# EAGLE schematic roverPCB (EAGLE 9.5.1)
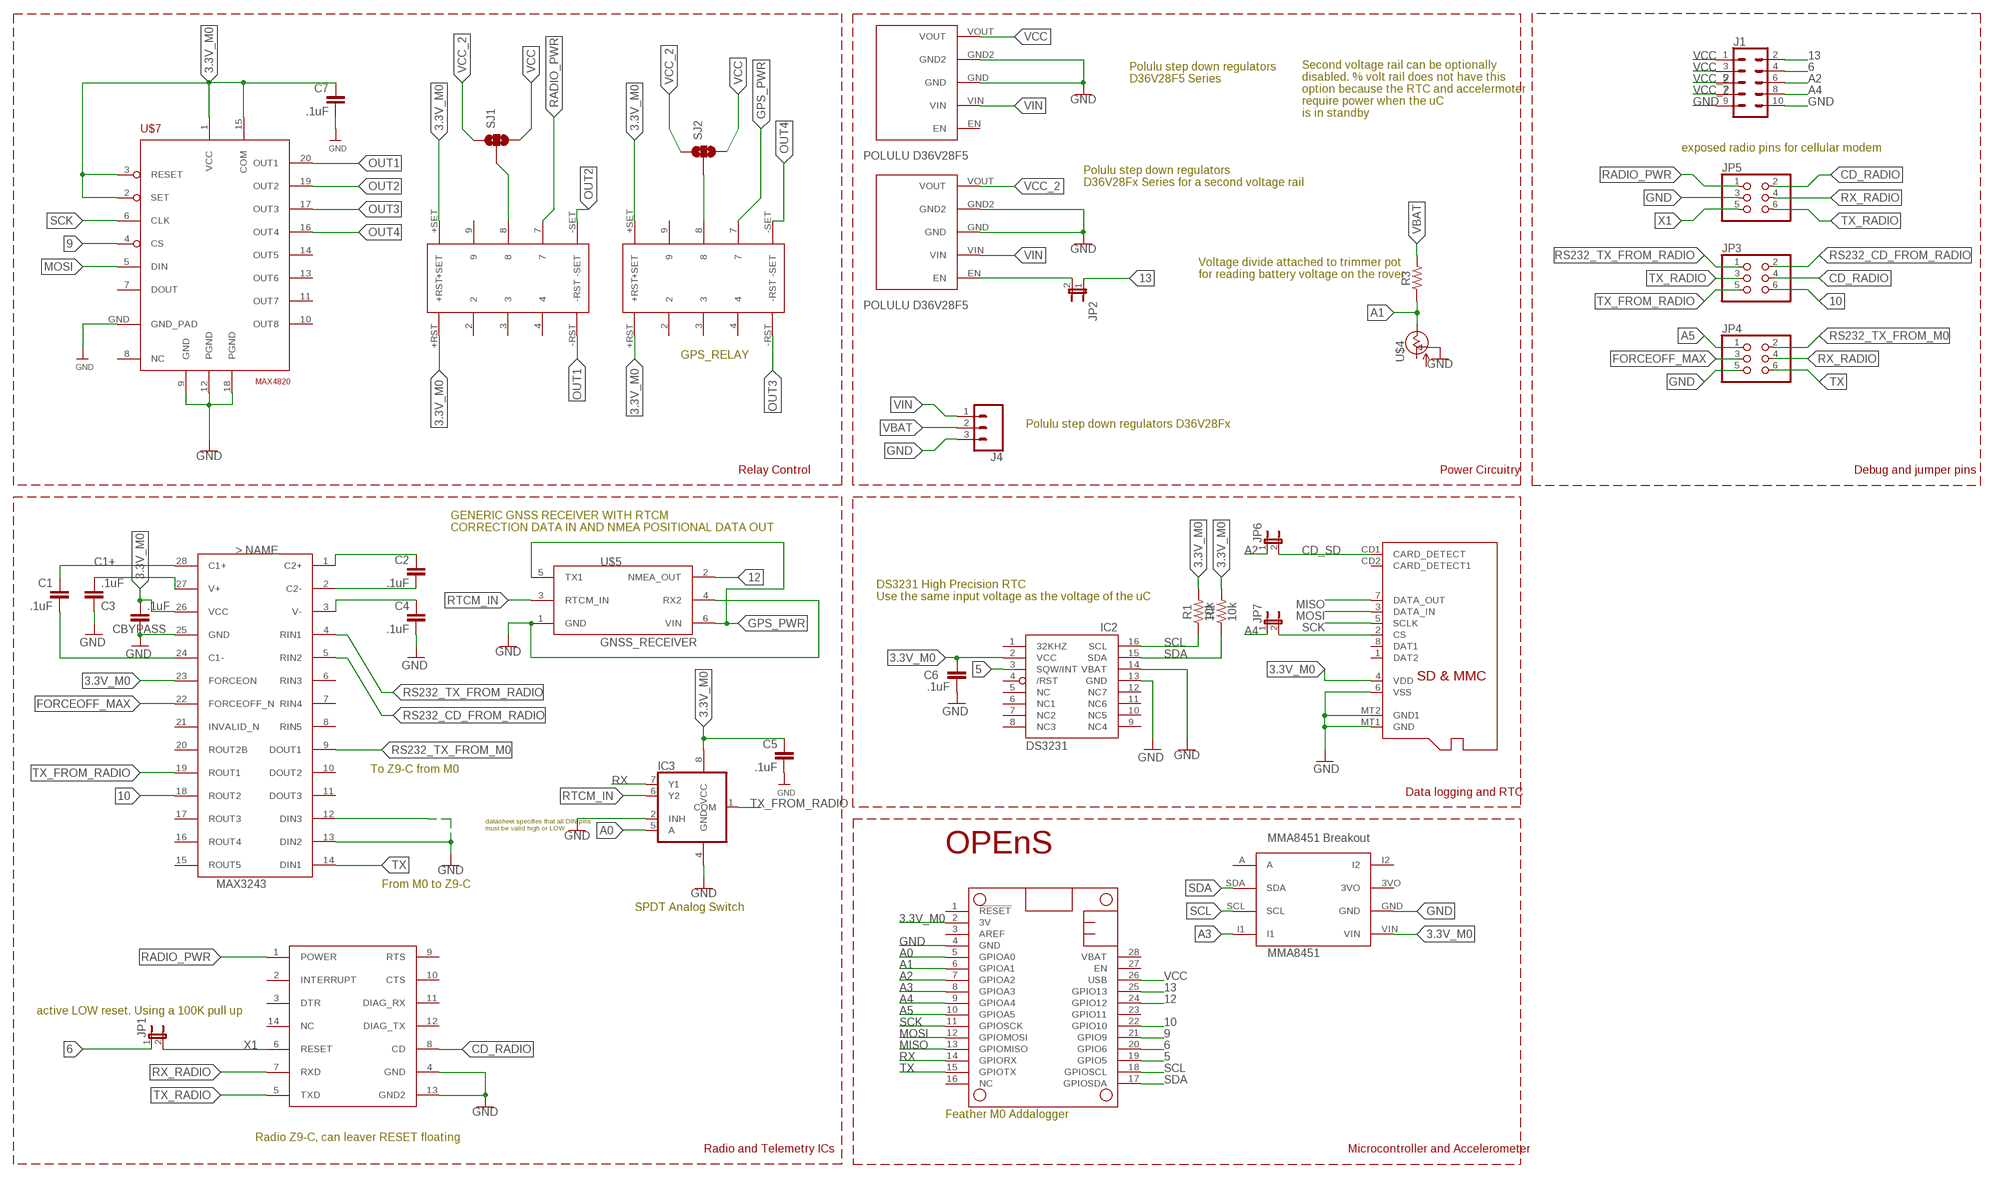
[diagram p0: schematic, sheet 1]

## Parts
C1  .1uF  CC1206  [C1206]
C2  .1uF  CC1206  [C1206]
C3  .1uF  CC1206  [C1206]
C4  .1uF  CC1206  [C1206]
C5  .1uF  CC1206  [C1206]
C6  .1uF  CC1206  [C1206]
C7  .1uF  CC1206  [C1206]
CBYPASS  .1uF  CC1206  [C1206]
IC2  DS3231/SO  [SO16W]
IC3  741G53DCT  [DCT_R-PDSO-G8]
J1  CONN_05X2NO_SILK  [2X5_NOSILK]
J4  CONN_03SCREW  [SCREWTERMINAL-3.5MM-3]
JP1  JP1E  [JP1]
JP2  JP1E  [JP1]
JP3  PINHD-2X3  [2X03]
JP4  PINHD-2X3  [2X03]
JP5  PINHD-2X3  [2X03]
JP6  JP1E  [JP1]
JP7  JP1E  [JP1]
MS1  FEATHERWING  [FEATHERWING]
R1  10k  0.27OHM-0603-1/10W-1%  [0603]
R2  10k  0.27OHM-0603-1/10W-1%  [0603]
R3  1.6KOHM-0603-1/10W-1%  [0603]
RF_CONVERT  MAX3243  [SSOP-28]
SJ1  SOLDERJUMPER_2WAY-OLDT  [SJ_2]
SJ2  SOLDERJUMPER_2WAY-OLDT  [SJ_2]
U$2  OPENS-LOGO  [OPENS-LOGO]
U$3  POLULU_D36V28FX  [POLULU_D36V28FX]
U$4  CT6EP205  [CT6]
U$5  GNSS_RECEIVER  [HDRV6W64P254_2X3_1016X508X838B]
U$7  MAX4820  [TSSOP20]
U$8  TQ2SS  [TQ2SS]
U$9  TQ2SS  [TQ2SS]
U$11  Z9-T/Z9-C  [Z9-T/Z9-C]
U$12  POLULU_D36V28FX  [POLULU_D36V28FX]
U$13  MMA8451  [MMA8451]
U$16  MICROSD  [MICROSD]

## Nets
3.3V_M0 [Power2]: C5.1 C6.1 C7.1 CBYPASS.2 IC2.2(VCC) IC3.8(VCC) MS1.2(3V) R1.2 R2.2 RF_CONVERT.23(FORCEON) RF_CONVERT.26(VCC) U$7.1(VCC) U$7.2(SET) U$7.3(RESET) U$7.15(COM) U$8.+RST U$8.+SET U$9.+RST U$9.+SET U$13.VIN U$16.4(VDD)
5: IC2.3(SQW/INT) MS1.19(GPIO5)
6: J1.4 JP1.1 MS1.20(GPIO6)
9: MS1.21(GPIO9) U$7.4(CS)
10: JP3.6 MS1.22(GPIO10) RF_CONVERT.18(ROUT2)
12: MS1.24(GPIO12) U$5.2(NMEA_OUT)
13: J1.2 JP2.1 MS1.25(GPIO13)
A0: IC3.5(A) MS1.5(GPIOA0)
A1: MS1.6(GPIOA1) R3.1 U$4.S(VSS)
A2: J1.6 JP6.1 MS1.7(GPIOA2)
A3: MS1.8(GPIOA3) U$13.I1
A4: J1.8 JP7.1 MS1.9(GPIOA4)
A5: JP4.1 MS1.10(GPIOA5)
C1+: C1.1 RF_CONVERT.28(C1+)
CD_RADIO: JP3.4 JP5.2 U$11.8(CD)
CD_SD: JP6.2 U$16.CD1(CARD_DETECT)
CS_SD: JP7.2 U$16.2(CS)
FORCEOFF_MAX: JP4.3 RF_CONVERT.22(FORCEOFF_N)
GND: C3.1 C4.2 C5.2 C6.2 C7.2 CBYPASS.1 IC2.13(GND) IC2.14(VBAT) IC3.2(INH) IC3.4(GND) J1.9 J1.10 J4.3 JP4.5 JP5.3 MS1.4(GND) RF_CONVERT.12(DIN3) RF_CONVERT.13(DIN2) RF_CONVERT.25(GND) U$3.GND U$3.GND2 U$4.A(OUT) U$5.1(GND) U$5.4(RX2) U$7.9(GND) U$7.12(PGND) U$7.18(PGND) U$7.GND(GND_PAD) U$11.4(GND) U$11.13(GND2) U$12.GND U$12.GND2 U$13.GND U$16.6(VSS) U$16.MT1(GND) U$16.MT2(GND1)
GPS_PWR: U$5.5(TX1) U$5.6(VIN) U$9.7
MISO: MS1.13(GPIOMISO) U$16.7(DATA_OUT)
MOSI: MS1.12(GPIOMOSI) U$7.5(DIN) U$16.3(DATA_IN)
N$1 [Power2]: SJ2.2 U$9.8
N$2 [Power2]: SJ1.2 U$8.8
N$4: C2.1 RF_CONVERT.1(C2+)
N$5: C2.2 RF_CONVERT.2(C2-)
N$10: C4.1 RF_CONVERT.3(V-)
N$11: C1.2 RF_CONVERT.24(C1-)
N$13: C3.2 RF_CONVERT.27(V+)
OUT1 [relay]: U$7.20(OUT1) U$8.-RST
OUT2 [relay]: U$7.19(OUT2) U$8.-SET
OUT3 [relay]: U$7.17(OUT3) U$9.-RST
OUT4 [relay]: U$7.16(OUT4) U$9.-SET
RADIO_PWR [Power]: JP5.1 U$8.7 U$11.1(POWER)
RS232_CD_FROM_RADIO: JP3.2 RF_CONVERT.5(RIN2)
RS232_TX_FROM_M0: JP4.2 RF_CONVERT.9(DOUT1)
RS232_TX_FROM_RADIO: JP3.1 RF_CONVERT.4(RIN1)
RTCM_IN: IC3.6(Y2) U$5.3(RTCM_IN)
RX: IC3.7(Y1) MS1.14(GPIORX)
RX_RADIO: JP4.4 JP5.4 U$11.7(RXD)
SCK: MS1.11(GPIOSCK) U$7.6(CLK) U$16.5(SCLK)
SCL: IC2.16(SCL) MS1.18(GPIOSCL) R1.1 U$13.SCL
SDA: IC2.15(SDA) MS1.17(GPIOSDA) R2.1 U$13.SDA
TX: JP4.6 MS1.15(GPIOTX) RF_CONVERT.14(DIN1)
TX_FROM_RADIO: IC3.1(COM) JP3.5 RF_CONVERT.19(ROUT1)
TX_RADIO: JP3.3 JP5.6 U$11.5(TXD)
VBAT: J4.2 R3.2
VCC [Power]: J1.1 J1.3 MS1.26(USB) SJ1.3 SJ2.3 U$3.VOUT
VCC_2 [Power]: J1.5 J1.7 SJ1.1 SJ2.1 U$12.VOUT
VIN [Power]: J4.1 U$3.VIN U$12.VIN
X1: JP1.2 JP5.5 U$11.6(RESET)
X2: JP2.2 U$12.EN
Unconnected: IC2.1(32KHZ) IC2.4(/RST) IC2.5(NC) IC2.6(NC1) IC2.7(NC2) IC2.8(NC3) IC2.9(NC4) IC2.10(NC5) IC2.11(NC6) IC2.12(NC7) MS1.1(!RESET) MS1.3(AREF) MS1.16(NC) MS1.23(GPIO11) MS1.27(EN) MS1.28(VBAT) RF_CONVERT.6(RIN3) RF_CONVERT.7(RIN4) RF_CONVERT.8(RIN5) RF_CONVERT.10(DOUT2) RF_CONVERT.11(DOUT3) RF_CONVERT.15(ROUT5) RF_CONVERT.16(ROUT4) RF_CONVERT.17(ROUT3) RF_CONVERT.20(ROUT2B) RF_CONVERT.21(INVALID_N) U$3.EN U$4.E(VDD) U$7.7(DOUT) U$7.8(NC) U$7.10(OUT8) U$7.11(OUT7) U$7.13(OUT6) U$7.14(OUT5) U$8.2 U$8.3 U$8.4 U$8.9 U$9.2 U$9.3 U$9.4 U$9.9 U$11.2(INTERRUPT) U$11.3(DTR) U$11.9(RTS) U$11.10(CTS) U$11.11(DIAG_RX) U$11.12(DIAG_TX) U$11.14(NC) U$13.3VO U$13.A U$13.I2 U$16.1(DAT2) U$16.8(DAT1) U$16.CD2(CARD_DETECT1)

## Notes on the sheet
- Polulu step down regulators 
  D36V28F5 Series
- Second voltage rail can be optionally
  disabled. % volt rail does not have this
  option because the RTC and accelermoter
  require power when the uC
  is in standby
- exposed radio pins for cellular modem
- Polulu step down regulators 
  D36V28Fx Series for a second voltage rail
- Voltage divide attached to trimmer pot 
  for reading battery voltage on the rover
- GPS_RELAY
- Polulu step down regulators D36V28Fx
- Relay Control | Power Circuitry | Debug and jumper pins
- GENERIC GNSS RECEIVER WITH RTCM
  CORRECTION DATA IN AND NMEA POSITIONAL DATA OUT
- DS3231 High Precision RTC
  Use the same input voltage as the voltage of the uC
- To Z9-C from M0
- Data logging and RTC
- datasheet specifies that all DIN pins 
  must be valid high or LOW
- From M0 to Z9-C
- SPDT Analog Switch
- active LOW reset. Using a 100K pull up
- Feather M0 Addalogger
- Radio Z9-C, can leaver RESET floating
- Radio and Telemetry ICs | Microcontroller and Accelerometer

## Library data of the parts
C1-C7 CBYPASS = eagle-ltspice:C: CAPACITOR, European symbol; SPICEMODEL: NONE; SPICEPREFIX: C
IC2 = adafruit:DS3231
IC3 = 74xx-little-de:74*1G53: SINGLE-POLE DOUBLE-THROW (SPDT) ANALOG SWITCH 2:1 ANALOG MULTIPLEXER/DEMULTIPLEXER Source: http://focus.ti.com/lit/ds/symlink/sn74lvc2g53.pdf
J1 = SparkFun-Connectors:CONN_05X2: Multi connection point. Often used as Generic Header-pin footprint for 0.1 inch spaced/style header connections For AVR SPI programming port, see special device with nice symbol: "AVR_SPI_PROG_5x2.dev" You can populate with any combo of single row headers, but if you'd like an exact match, check these: 2x5 AVR ICSP Male Header <https://www.sparkfun.com/products/778> (PRT-00778) 2x5 Pin Shrouded Header <https://www.sparkfun.com/products/8506> (PRT-08506) On any of the 0.1 inch spaced packages, you can populate with these: Break Away Headers - Straight <https://www.sparkfun.com/products/116> (PRT-00116) Break Away Male Headers - Right Angle <https://www.sparkfun.com/products/553> (PRT-00553) Female Headers <https://www.sparkfun.com/products/115> (PRT-00115) Break Away Headers - Machine Pin <https://www.sparkfun.com/products/117> (PRT-00117) Break Away Female Headers - Swiss Machine Pin <https://www.sparkfun.com/products/743> (PRT-00743) Special note: the shrouded connector mates well with our 5x2 ribbon cables: 2x5 Pin IDC Ribbon Cable <https://www.sparkfun.com/products/8535> (PRT-08535)
J4 = SparkFun-Connectors:CONN_03: Multi connection point. Often used as Generic Header-pin footprint for 0.1 inch spaced/style header connections On any of the 0.1 inch spaced packages, you can populate with these: Break Away Headers - Straight <https://www.sparkfun.com/products/116> (PRT-00116) Break Away Male Headers - Right Angle <https://www.sparkfun.com/products/553> (PRT-00553) Female Headers <https://www.sparkfun.com/products/115> (PRT-00115) Break Away Headers - Machine Pin <https://www.sparkfun.com/products/117> (PRT-00117) Break Away Female Headers - Swiss Machine Pin <https://www.sparkfun.com/products/743> (PRT-00743) Stackable Header - 3 Pin (Female, 0.1") <https://www.sparkfun.com/products/13875> (PRT-13875) For SCREWTERMINALS and SPRING TERMINALS visit here: Screw Terimnals on SparkFun.com <https://www.sparkfun.com/search/results?term=Screw+Terminals> (5mm/3.5mm/2.54mm spacing) This device is also useful as a general connection point to wire up your design to another part of your project. Our various solder wires solder well into these plated through hole pads. Hook-Up Wire - Assortment (Stranded, 22 AWG) <https://www.sparkfun.com/products/11375> (PRT-11375) Hook-Up Wire - Assortment (Solid Core, 22 AWG) <https://www.sparkfun.com/products/11367> (PRT-11367) View the entire wire category on our website here <https://www.sparkfun.com/categories/141> Special notes: Molex polarized connector foot print use with SKU : PRT-08232 with associated crimp pins and housings.; PROD_ID: CONN-08288; SF_ID: PRT-08235
JP1 JP2 JP6 JP7 = jumper:JP1E: JUMPER
JP3-JP5 = pinhead:PINHD-2X3: PIN HEADER
MS1 = adafruit:FEATHERWING
R1 R2 = SparkFun-Resistors:0.27OHM: 0.27Ω resistor A resistor is a passive two-terminal electrical component that implements electrical resistance as a circuit element. Resistors act to reduce current flow, and, at the same time, act to lower voltage levels within circuits. - Wikipedia; PROD_ID: RES-08787; VALUE: 0.27
R3 = SparkFun-Resistors:1.6KOHM: 1.6kΩ resistor A resistor is a passive two-terminal electrical component that implements electrical resistance as a circuit element. Resistors act to reduce current flow, and, at the same time, act to lower voltage levels within circuits. - Wikipedia; PROD_ID: RES-08361; VALUE: 1.6k
RF_CONVERT = ftdi4:MAX3243: MAX3243 RS232 interface 5 receive lines 3 line drives 5V or 3.3V operating voltage
SJ1 SJ2 = SparkFun-Retired:SOLDERJUMPER_2WAY-OLD: Solder Jumper 2 way solder jumper
U$2 = opens-logo:OPENS-LOGO: OPENS Lab Logo
U$3 U$12 = SlideSentinel:POLULU_D36V28FX
U$4 = tango:CT6EP205
U$5 = SlideSentinel:GNSS_RECEIVER
U$7 = MAX4820:MAX4820
U$8 U$9 = SlideSentinel:TQ2SS
U$11 = SlideSentinel:Z9-T/Z9-C
U$13 = SlideSentinel:MMA8451
U$16 = adafruit:MICROSD: Micro-SD / Transflash card holder with SPI pinout For the 3M # 2908-05WB-MG and/or 4UCON #19656 push-push type

## Net classes
0 default: width 0.203 mm, drill 0.203 mm, clearance 0.178 mm
1 Power: width 0.635 mm, drill 0.635 mm, clearance 0.584 mm
2 Power2: width 0.457 mm, drill 0.457 mm, clearance 0.178 mm
3 relay: width 0.305 mm, drill 0.305 mm, clearance 0.178 mm